# EAGLE schematic usb_shield (EAGLE 7.2.0)
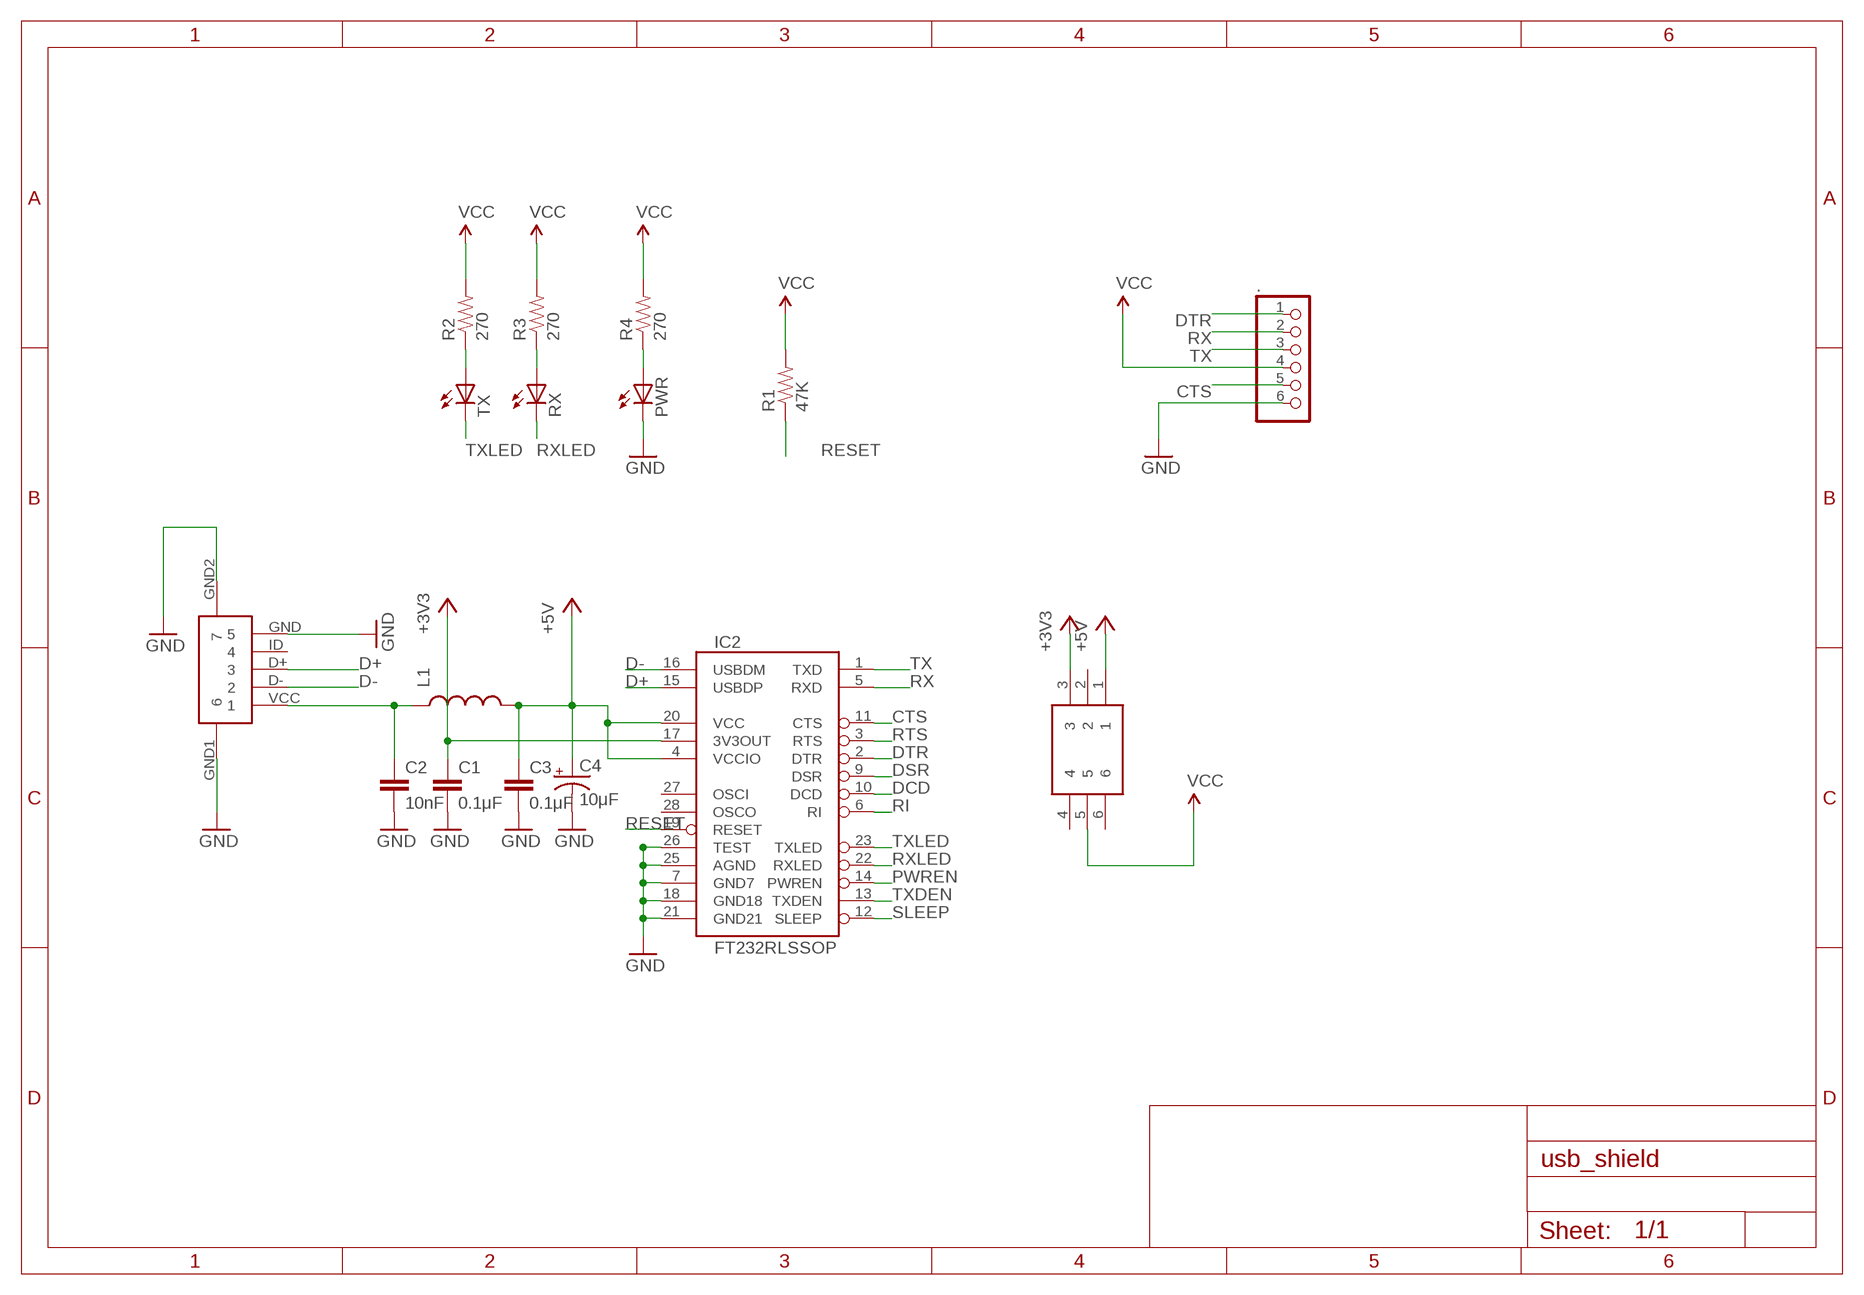
[diagram p0: schematic, sheet 1]

## Parts
.  PINHD-1X6  [1X06]
C1  0.1μF  CAP0603-CAP  [0603-CAP]
C2  10nF  CAP0603-CAP  [0603-CAP]
C3  0.1μF  CAP0603-CAP  [0603-CAP]
C4  10μF  CAP_POL1206  [EIA3216]
IC2  FT232RLSSOP  [SSOP28DB]
L1  INDUCTOR0603  [0603]
PWR  LEDCHIP-LED0805  [CHIP-LED0805]
R1  47K  RESISTOR0603-RES  [0603-RES]
R2  270  RESISTOR0603-RES  [0603-RES]
R3  270  RESISTOR0603-RES  [0603-RES]
R4  270  RESISTOR0603-RES  [0603-RES]
RX  LEDCHIP-LED0805  [CHIP-LED0805]
TX  LEDCHIP-LED0805  [CHIP-LED0805]
U$1  USB-MICRO-B-FEMALE  [USB-MICRO-B-FEMALE]
U$2  C&K_JS202011SCQN  [C&K_JS202011SCQN]

## Nets
+3V3: C1.1 IC2.17(3V3OUT) U$2.3
+5V: C3.1 C4.A(+) IC2.4(VCCIO) IC2.20(VCC) L1.2 U$2.1
CTS: ..5 IC2.11(CTS)
D+: IC2.15(USBDP) U$1.D+
D-: IC2.16(USBDM) U$1.D-
DCD: IC2.10(DCD)
DSR: IC2.9(DSR)
DTR: ..1 IC2.2(DTR)
GND: ..6 C1.2 C2.2 C3.2 C4.C(-) IC2.7(GND7) IC2.18(GND18) IC2.21(GND21) IC2.25(AGND) IC2.26(TEST) PWR.C U$1.GND U$1.GND1 U$1.GND2
N$1: C2.1 L1.1 U$1.VCC
N$2: R2.1 TX.A
N$5: R3.1 RX.A
N$6: PWR.A R4.1
PWREN: IC2.14(PWREN)
RESET: IC2.19(RESET) R1.1
RI: IC2.6(RI)
RTS: IC2.3(RTS)
RX: ..2 IC2.5(RXD)
RXLED: IC2.22(RXLED) RX.C
SLEEP: IC2.12(SLEEP)
TX: ..3 IC2.1(TXD)
TXDEN: IC2.13(TXDEN)
TXLED: IC2.23(TXLED) TX.C
VCC: ..4 R1.2 R2.2 R3.2 R4.2 U$2.5
Unconnected: IC2.27(OSCI) IC2.28(OSCO) U$1.ID U$2.2 U$2.4 U$2.6

## Library data of the parts
. = adafruit:PINHD-1X6: PIN HEADER
C1-C3 = SparkFun:CAP: Capacitor Standard 0603 ceramic capacitor, and 0.1" leaded capacitor.
C4 = SparkFun:CAP_POL: Capacitor Polarized These are standard SMD and PTH capacitors. Normally 10uF, 47uF, and 100uF in electrolytic and tantalum varieties. Always verify the external diameter of the through hole cap, it varies with capacity, voltage, and manufacturer. The EIA devices should be standard.
IC2 = SparkFun:FT232RL: USB UART FT232RL 4th Generation USB UART (USB <-> Serial) Controller. Spark Fun Electronics SKU : COM-00650
L1 = SparkFun:INDUCTOR: Inductors Basic Inductor/Choke - 0603 and 1206. Footprints are not proven and vary greatly between part numbers.
PWR RX TX = adafruit:LED: LED OSRAM: - CHIPLED LG R971, LG N971, LY N971, LG Q971, LY Q971, LO R971, LY R971 LH N974, LH R974 LS Q976, LO Q976, LY Q976 LO Q996 - Hyper CHIPLED LW Q18S LB Q993, LB Q99A, LB R99A - SideLED LS A670, LO A670, LY A670, LG A670, LP A670 LB A673, LV A673, LT A673, LW A673 LH A674 LY A675 LS A676, LA A676, LO A676, LY A676, LW A676 LS A679, LY A679, LG A679 - Hyper Micro SIDELED® LS Y876, LA Y876, LO Y876, LY Y876 LT Y87S - SmartLED LW L88C, LW L88S LB L89C, LB L89S, LG L890 LS L89K, LO L89K, LY L89K LS L896, LA L896, LO L896, LY L896 - TOPLED LS T670, LO T670, LY T670, LG T670, LP T670 LSG T670, LSP T670, LSY T670, LOP T670, LYG T670 LG T671, LOG T671, LSG T671 LB T673, LV T673, LT T673, LW T673 LH T674 LS T676, LA T676, LO T676, LY T676, LB T676, LH T676, LSB T676, LW T676 LB T67C, LV T67C, LT T67C, LS T67K, LO T67K, LY T67K, LW E67C LS E67B, LA E67B, LO E67B, LY E67B, LB E67C, LV E67C, LT E67C LW T67C LS T679, LY T679, LG T679 LS T770, LO T770, LY T770, LG T770, LP T770 LB T773, LV T773, LT T773, LW T773 LH T774 LS E675, LA E675, LY E675, LS T675 LS T776, LA T776, LO T776, LY T776, LB T776 LHGB T686 LT T68C, LB T68C - Hyper Mini TOPLED® LB M676 - Mini TOPLED Santana® LG M470 LS M47K, LO M47K, LY M47K Source: http://www.osram.convergy.de/
R1-R4 = SparkFun:RESISTOR: Resistor Basic schematic elements and footprints for 0603, 1206, and PTH resistors.
U$1 = gclue:USB-MICRO-B-FEMALE
U$2 = gclueParts:C&K_JS202011SCQN